# Altium schematic sheet CV060_IO.SchDoc
size A4
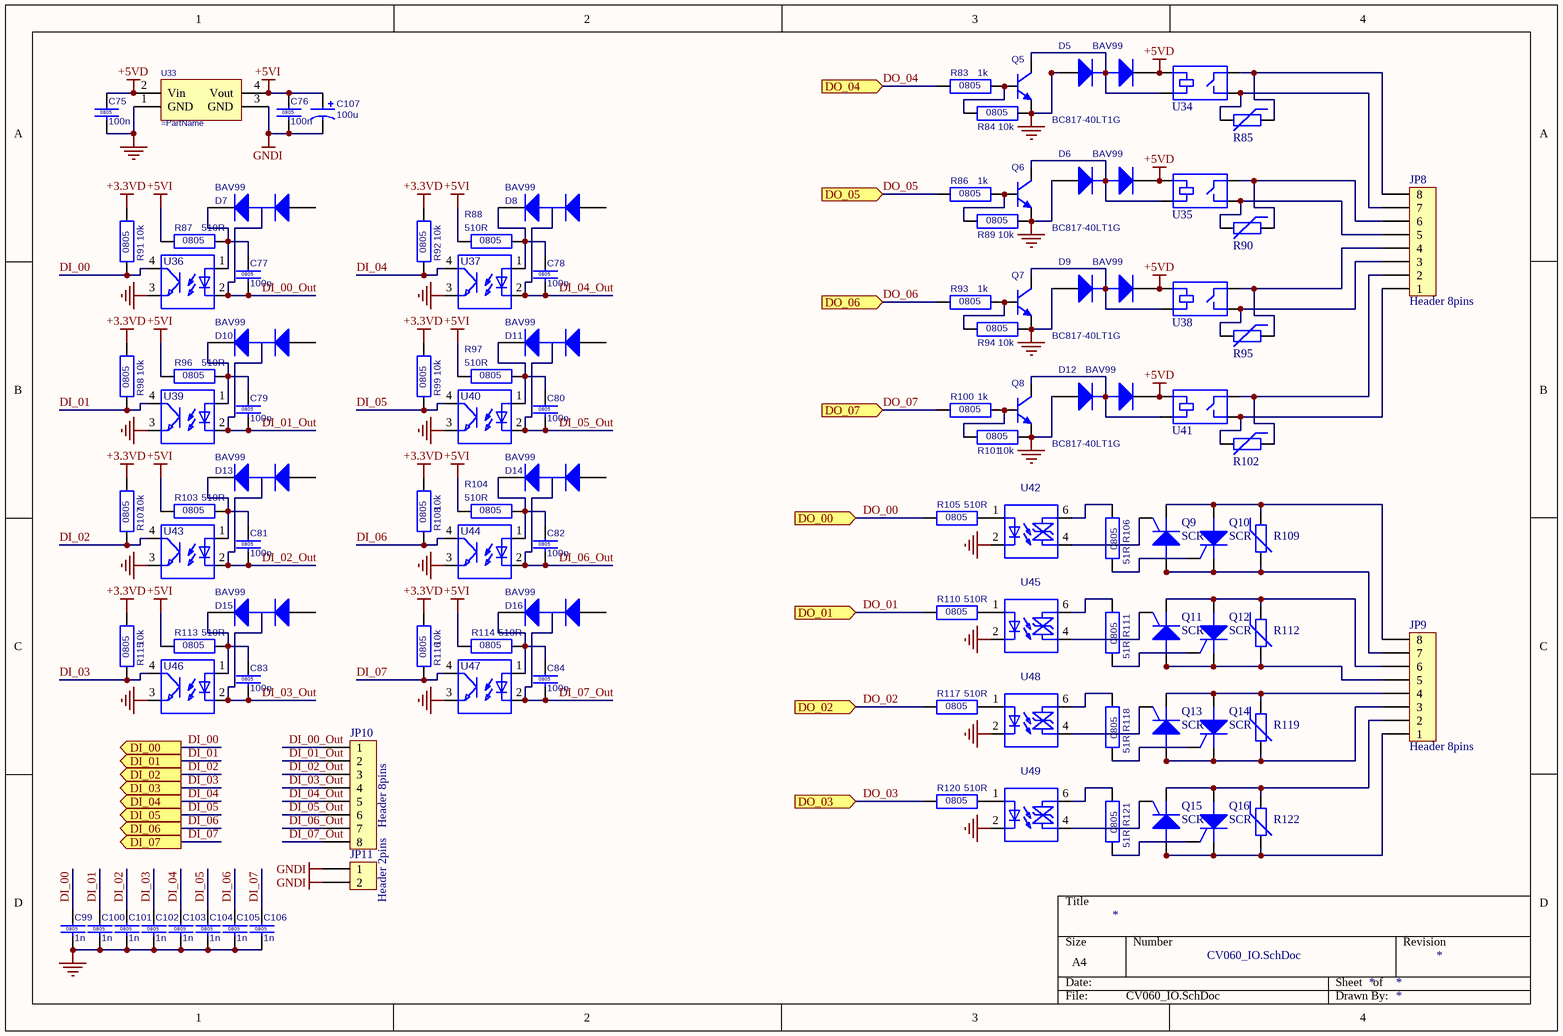
[diagram p0: CV060_IO.SchDoc]

## Parts
C75  Case: 0805  [RC0805]  (hidden comment: 100n)
C76  Case: 0805  [RC0805]  (hidden comment: 100n)
C77  Case: 0805  [RC0805]  (hidden comment: 100n)
C78  Case: 0805  [RC0805]  (hidden comment: 100n)
C79  Case: 0805  [RC0805]  (hidden comment: 100n)
C80  Case: 0805  [RC0805]  (hidden comment: 100n)
C81  Case: 0805  [RC0805]  (hidden comment: 100n)
C82  Case: 0805  [RC0805]  (hidden comment: 100n)
C83  Case: 0805  [RC0805]  (hidden comment: 100n)
C84  Case: 0805  [RC0805]  (hidden comment: 100n)
C99  Case: 0805  [RC0805]  (hidden comment: 1n)
C100  Case: 0805  [RC0805]  (hidden comment: 1n)
C101  Case: 0805  [RC0805]  (hidden comment: 1n)
C102  Case: 0805  [RC0805]  (hidden comment: 1n)
C103  Case: 0805  [RC0805]  (hidden comment: 1n)
C104  Case: 0805  [RC0805]  (hidden comment: 1n)
C105  Case: 0805  [RC0805]  (hidden comment: 1n)
C106  Case: 0805  [RC0805]  (hidden comment: 1n)
C107  100u  [CEH12.5D5P2.5]
D5  BAV99  [SOT23-3]
D6  BAV99  [SOT23-3]
D7  BAV99  [SOT23-3]
D8  BAV99  [SOT23-3]
D9  BAV99  [SOT23-3]
D10  BAV99  [SOT23-3]
D11  BAV99  [SOT23-3]
D12  BAV99  [SOT23-3]
D13  BAV99  [SOT23-3]
D14  BAV99  [SOT23-3]
D15  BAV99  [SOT23-3]
D16  BAV99  [SOT23-3]
JP8  Header 8pins  [PHOENIX_5.08_8PINS]
JP9  Header 8pins  [PHOENIX_5.08_8PINS]
JP10  Header 8pins  [PHOENIX_5.08_8PINS]
JP11  Header 2pins  [PHOENIX_5.08_2PINS]
Q5  Part number: BC817-40LT1G  [SOT23-3]  (hidden comment: NPN_transistor_SOT23-3)
Q6  Part number: BC817-40LT1G  [SOT23-3]  (hidden comment: NPN_transistor_SOT23-3)
Q7  Part number: BC817-40LT1G  [SOT23-3]  (hidden comment: NPN_transistor_SOT23-3)
Q8  Part number: BC817-40LT1G  [SOT23-3]  (hidden comment: NPN_transistor_SOT23-3)
Q9  SCR  [TO-220AB_V]
Q10  SCR  [TO-220AB_V]
Q11  SCR  [TO-220AB_V]
Q12  SCR  [TO-220AB_V]
Q13  SCR  [TO-220AB_V]
Q14  SCR  [TO-220AB_V]
Q15  SCR  [TO-220AB_V]
Q16  SCR  [TO-220AB_V]
R83  Case: 0805  [RC0805]  (hidden comment: 1k)
R84  Case: 0805  [RC0805]  (hidden comment: 10k)
R85  Varistor  [ROV07]  (value not drawn)
R86  Case: 0805  [RC0805]  (hidden comment: 1k)
R87  Case: 0805  [RC0805]  (hidden comment: 510R)
R88  Case: 0805  [RC0805]  (hidden comment: 510R)
R89  Case: 0805  [RC0805]  (hidden comment: 10k)
R90  Varistor  [ROV07]  (value not drawn)
R91  Case: 0805  [RC0805]  (hidden comment: 10k)
R92  Case: 0805  [RC0805]  (hidden comment: 10k)
R93  Case: 0805  [RC0805]  (hidden comment: 1k)
R94  Case: 0805  [RC0805]  (hidden comment: 10k)
R95  Varistor  [ROV07]  (value not drawn)
R96  Case: 0805  [RC0805]  (hidden comment: 510R)
R97  Case: 0805  [RC0805]  (hidden comment: 510R)
R98  Case: 0805  [RC0805]  (hidden comment: 10k)
R99  Case: 0805  [RC0805]  (hidden comment: 10k)
R100  Case: 0805  [RC0805]  (hidden comment: 1k)
R101  Case: 0805  [RC0805]  (hidden comment: 10k)
R102  Varistor  [ROV07]  (value not drawn)
R103  Case: 0805  [RC0805]  (hidden comment: 510R)
R104  Case: 0805  [RC0805]  (hidden comment: 510R)
R105  Case: 0805  [RC0805]  (hidden comment: 510R)
R106  Case: 0805  [RC0805]  (hidden comment: 51R)
R107  Case: 0805  [RC0805]  (hidden comment: 10k)
R108  Case: 0805  [RC0805]  (hidden comment: 10k)
R109  Varistor  [ROV07]  (value not drawn)
R110  Case: 0805  [RC0805]  (hidden comment: 510R)
R111  Case: 0805  [RC0805]  (hidden comment: 51R)
R112  Varistor  [ROV07]  (value not drawn)
R113  Case: 0805  [RC0805]  (hidden comment: 510R)
R114  Case: 0805  [RC0805]  (hidden comment: 510R)
R115  Case: 0805  [RC0805]  (hidden comment: 10k)
R116  Case: 0805  [RC0805]  (hidden comment: 10k)
R117  Case: 0805  [RC0805]  (hidden comment: 510R)
R118  Case: 0805  [RC0805]  (hidden comment: 51R)
R119  Varistor  [ROV07]  (value not drawn)
R120  Case: 0805  [RC0805]  (hidden comment: 510R)
R121  Case: 0805  [RC0805]  (hidden comment: 51R)
R122  Varistor  [ROV07]  (value not drawn)
U33  (no value)  [SIP4]
U34  NPA-AS5-DC5V  [NPA-AS5-DC5V]  (value not drawn)
U35  NPA-AS5-DC5V  [NPA-AS5-DC5V]  (value not drawn)
U36  PC817  [DIP4]  (value not drawn)
U37  PC817  [DIP4]  (value not drawn)
U38  NPA-AS5-DC5V  [NPA-AS5-DC5V]  (value not drawn)
U39  PC817  [DIP4]  (value not drawn)
U40  PC817  [DIP4]  (value not drawn)
U41  NPA-AS5-DC5V  [NPA-AS5-DC5V]  (value not drawn)
U42  MOC3063  [DIP6]  (value not drawn)
U43  PC817  [DIP4]  (value not drawn)
U44  PC817  [DIP4]  (value not drawn)
U45  MOC3063  [DIP6]  (value not drawn)
U46  PC817  [DIP4]  (value not drawn)
U47  PC817  [DIP4]  (value not drawn)
U48  MOC3063  [DIP6]  (value not drawn)
U49  MOC3063  [DIP6]  (value not drawn)

## Ports
DI_00 (out), DI_01 (out), DI_02 (out), DI_03 (out), DI_04 (out), DI_05 (out), DI_06 (out), DI_07 (out), DO_00 (in), DO_01 (in), DO_02 (in), DO_03 (in), DO_04 (in), DO_05 (in), DO_06 (in), DO_07 (in)

## Nets
+3.3VD: R91.2 R92.2 R98.2 R99.2 R107.2 R108.2 R115.2 R116.2
+5VD: C75.1 D5.2(K) D6.2(K) D9.2(K) D12.2(K) U33.2(Vin) U34.1 U35.1 U38.1 U41.1
+5VI: C76.1 C107.1 R87.1 R88.1 R96.1 R97.1 R103.1 R104.1 R113.1 R114.1 U33.4(Vout)
DGND: C75.2 C99.2 C100.2 C101.2 C102.2 C103.2 C104.2 C105.2 C106.2 D5.1(A) D6.1(A) D9.1(A) D12.1(A) Q5.2(E) Q6.2(E) Q7.2(E) Q8.2(E) R84.2 R89.2 R94.2 R101.2 U33.1(GND) U36.3 U37.3 U39.3 U40.3 U42.2 U43.3 U44.3 U45.2 U46.3 U47.3 U48.2 U49.2
GNDI: C76.2 C107.2 JP11.1 JP11.2 U33.3(GND)
DI_00: C99.1 R91.1 U36.4 ; port DI_00
DI_00_Out: C77.2 D7.3(C) JP10.1 U36.2
DI_01: C100.1 R98.1 U39.4 ; port DI_01
DI_01_Out: C79.2 D10.3(C) JP10.2 U39.2
DI_02: C101.1 R107.1 U43.4 ; port DI_02
DI_02_Out: C81.2 D13.3(C) JP10.3 U43.2
DI_03: C102.1 R115.1 U46.4 ; port DI_03
DI_03_Out: C83.2 D15.3(C) JP10.4 U46.2
DI_04: C103.1 R92.1 U37.4 ; port DI_04
DI_04_Out: C78.2 D8.3(C) JP10.5 U37.2
DI_05: C104.1 R99.1 U40.4 ; port DI_05
DI_05_Out: C80.2 D11.3(C) JP10.6 U40.2
DI_06: C105.1 R108.1 U44.4 ; port DI_06
DI_06_Out: C82.2 D14.3(C) JP10.7 U44.2
DI_07: C106.1 R116.1 U47.4 ; port DI_07
DI_07_Out: C84.2 D16.3(C) JP10.8 U47.2
DO_00: R105.1 ; port DO_00
DO_01: R110.1 ; port DO_01
DO_02: R117.1 ; port DO_02
DO_03: R120.1 ; port DO_03
DO_04: R83.1 ; port DO_04
DO_05: R86.1 ; port DO_05
DO_06: R93.1 ; port DO_06
DO_07: R100.1 ; port DO_07
NetC77_1: C77.1 D7.2(K) R87.2 U36.1
NetC78_1: C78.1 D8.2(K) R88.2 U37.1
NetC79_1: C79.1 D10.2(K) R96.2 U39.1
NetC80_1: C80.1 D11.2(K) R97.2 U40.1
NetC81_1: C81.1 D13.2(K) R103.2 U43.1
NetC82_1: C82.1 D14.2(K) R104.2 U44.1
NetC83_1: C83.1 D15.2(K) R113.2 U46.1
NetC84_1: C84.1 D16.2(K) R114.2 U47.1
NetD5_3: D5.3(C) Q5.3(C) U34.2
NetD6_3: D6.3(C) Q6.3(C) U35.2
NetD9_3: D9.3(C) Q7.3(C) U38.2
NetD12_3: D12.3(C) Q8.3(C) U41.2
NetJP8_1: JP8.1 R102.2 U41.4
NetJP8_2: JP8.2 R102.1 U41.3
NetJP8_3: JP8.3 R95.2 U38.4
NetJP8_4: JP8.4 R95.1 U38.3
NetJP8_5: JP8.5 R90.2 U35.4
NetJP8_6: JP8.6 R90.1 U35.3
NetJP8_7: JP8.7 R85.2 U34.4
NetJP8_8: JP8.8 R85.1 U34.3
NetJP9_1: JP9.1 Q15.2(A) Q15.4(TAB) Q16.1(K) R122.2
NetJP9_2: JP9.2 Q15.1(K) Q16.2(A) Q16.4(TAB) R122.1
NetJP9_3: JP9.3 Q13.2(A) Q13.4(TAB) Q14.1(K) R119.2
NetJP9_4: JP9.4 Q13.1(K) Q14.2(A) Q14.4(TAB) R119.1
NetJP9_5: JP9.5 Q11.2(A) Q11.4(TAB) Q12.1(K) R112.2
NetJP9_6: JP9.6 Q11.1(K) Q12.2(A) Q12.4(TAB) R112.1
NetJP9_7: JP9.7 Q9.2(A) Q9.4(TAB) Q10.1(K) R109.2
NetJP9_8: JP9.8 Q9.1(K) Q10.2(A) Q10.4(TAB) R109.1
NetQ5_1: Q5.1(B) R83.2 R84.1
NetQ6_1: Q6.1(B) R86.2 R89.1
NetQ7_1: Q7.1(B) R93.2 R94.1
NetQ8_1: Q8.1(B) R100.2 R101.1
NetQ9_3: Q9.3(G) U42.4
NetQ10_3: Q10.3(G) R106.2
NetQ11_3: Q11.3(G) U45.4
NetQ12_3: Q12.3(G) R111.2
NetQ13_3: Q13.3(G) U48.4
NetQ14_3: Q14.3(G) R118.2
NetQ15_3: Q15.3(G) U49.4
NetQ16_3: Q16.3(G) R121.2
NetR105_2: R105.2 U42.1
NetR106_1: R106.1 U42.6
NetR110_2: R110.2 U45.1
NetR111_1: R111.1 U45.6
NetR117_2: R117.2 U48.1
NetR118_1: R118.1 U48.6
NetR120_2: R120.2 U49.1
NetR121_1: R121.1 U49.6

Not connected (* = marked no-connect by the designer): D7 1(A); D8 1(A); D10 1(A); D11 1(A); D13 1(A); D14 1(A); D15 1(A); D16 1(A)

## Library data of the parts
C75-C84 = CC0805K-X5R-50V0-100N: Chip capacitor, 20p; Manufacturer: KEMET, YAGEO; Voltage: 50V; Tolerance: 10%; ROSH: Yes; Material: X5R; Package: 7" paper reel; Part number: CC0805K-X5R-50V0-100N; Suppliers: Avnet; Temperature: -55 - +125 C; Value: 100n; Supplier: Avnet-Abacus; Pb Free: Yes; Component Type: Standard; ComponentLink1Description: Manufacturer Link; ComponentLink2Description: Datasheet; ComponentLink2URL: http://www.yageo.com/pdf/UPY-GPHC_X5R_6.3V-to-50V_3.pdf; Published: 05.04.2010; Publisher: ppavlov
C99-C106 = CC0805K-X5R-50V0-1N00: Chip capacitor, 20p; Manufacturer: KEMET, YAGEO; Voltage: 50V; Tolerance: 10%; ROSH: Yes; Material: X5R; Package: 7" paper reel; Part number: CC0805K-X5R-50V0-1N00; Suppliers: Avnet; Temperature: -55 - +125 C; Value: 1n; Supplier: Avnet-Abacus; Pb Free: Yes; Component Type: Standard; ComponentLink1Description: Manufacturer Link; ComponentLink2Description: Datasheet; ComponentLink2URL: http://www.yageo.com/pdf/UPY-GPHC_X5R_6.3V-to-50V_3.pdf; Published: 05.04.2010; Publisher: ppavlov
C107 = CEH12.5D5P2.5M-16V-100U: Electrolytic capacitor; Manufacturer: Panasonic; Manufacturer Part Number: C H12.5D5P2.5M-16V-100U; Voltage: 16V; Tolerance: 20%; Pb Free: Yes; Case: 12.5x5x2.5; Value: 100u; Part Number: CEH12.5D5P2.5M-16V-100U; Temperature: -55 - +105 C; Supplier: Megasan; MOQ: 500; Component Type: Standard; ComponentLink1Description: Manufacturer Link; ComponentLink2Description: Datasheet; ComponentLink2URL: http://industrial.panasonic.com/www-data/pdf/ABA0000/ABA0000CE22.pdf; Published: 11.12.2009; Publisher: ppavlov
D5-D16 = BAV99: Dual small signal diode; Manufacturer: Fairchild; Forward current: 0.2A; Breakdown Voltage: 70V; Pb Free: Yes; Stock ID: D040; Temperature: -55 - +150 C; Supplier: EBV; Manufacturer Part Number: BAV99; Component Type: Standard; ComponentLink1Description: Manufacturer Link; Case: SOT23-3; ComponentLink2Description: Datasheet; ComponentLink2URL: http://www.fairchildsemi.com/ds/BA%2FBAV99.pdf; Published: 16.11.2009; Publisher: tkondratyuk; Part Number: BAV99; Current: 0.2A; Voltage: 70V
JP8-JP10 = 2EDGR-5.08-08P-14: 5.08mm angled 8pins receptabe; Manufacturer Part Number: 2EDGR-5.0-08P-14; Pins number: 8; Pb Free: Yes; Part Number: 2EDGR-5.08-08P-14; Temperature: -40 - +105 C; Supplier: Biakom; Component Type: Standard; ComponentLink1Description: Manufacturer Link; Case: PHOENIX_5.08_8PINS; ComponentLink2Description: Datasheet; Published: 17.08.2010; Publisher: ppavlov
JP11 = 2EDGR-5.08-02P-14: 5mm angled 2pins receptabe; Manufacturer Part Number: 2EDGR-5.0-02P-14; Pins number: 2; Pb Free: Yes; Part Number: 2EDGR-5.08-02P-14; Temperature: -40 - +105 C; Component Type: Standard; ComponentLink1Description: Manufacturer Link; Case: PHOENIX_5.08_2PINS; ComponentLink2Description: Datasheet; Published: 04.01.2010; Publisher: ppavlov
Q5-Q8 = BC817-40LT1G: General Purpose  NPN Transistor; Manufacturer: ONS, NXP; Manufacturer Part Number: BC817?40LT1G; Current: 0.5A; Voltage CEO: 40V; Pb Free: Yes; Temperature: -55 - +150 C; Supplier: EBV; MOQ: 3000; Package: Tape and Reel; Component Type: Standard; ComponentLink1Description: Manufacturer Link; Case: SOT23-3; ComponentLink2Description: Datasheet; ComponentLink2URL: http://www.onsemi.com/pub/Collateral/BC817-16LT1-D.PDF; Published: 16.02.2010; Publisher: ppavlov
Q9-Q16 = BT151-800_V: Thyristor; Current: 8A; Voltage CEO: 800; Pb Free: Yes; Part Number: BT151-800_V; Temperature: -55 - +150 C; Manufacturer Part Number: BT151-800; Component Type: Standard; ComponentLink1Description: Manufacturer Link; Case: TO-220AB_H; ComponentLink2Description: Datasheet; Published: 08.04.2010; Publisher: ppavlov
R83 R86 R93 R100 = RC0805F-1K00: Chip resistor; Manufacturer: PHILIPS, SAMSUNG; Voltage: 200V; Power: 1/10W; Tolerance: 1%; Pb Free: Yes; Value: 1k; Part Number: RC0805F-1K00; Temperature: -55 - +155 C; Supplier: Megasan; Component Type: Standard; ComponentLink1Description: Manufacturer Link; ComponentLink2Description: Datasheet; ComponentLink2URL: http://www.yageo.com/pdf/PYu-RC1206_51_RoHS_L_4.pdf; Published: 11.12.2009; Publisher: ppavlov
R84 R89 R91 R92 R94 R98 R99 R101 R107 R108 R115 R116 = RC0805F-10K0: Chip resistor; Manufacturer: PHILIPS, SAMSUNG; Voltage: 200V; Power: 1/10W; Tolerance: 1%; Pb Free: Yes; Value: 10k; Part Number: RC0805F-10K0; Temperature: -55 - +155 C; Supplier: Megasan; Component Type: Standard; ComponentLink1Description: Manufacturer Link; ComponentLink2Description: Datasheet; ComponentLink2URL: http://www.yageo.com/pdf/PYu-RC1206_51_RoHS_L_4.pdf; Published: 11.12.2009; Publisher: ppavlov
R85 R90 R95 R102 R109 R112 R119 R122 = ROV07-391K: Manufacturer: Raychem; Manufacturer Part Number: ROV07-361K; Current: 10A; Voltage: 250AC; Pb Free: Yes; Part Number: ROV07-391K; Temperature: -40 - +125 C; Component Type: Standard; ComponentLink1Description: Manufacturer Link; Case: ROV07; ComponentLink2Description: Datasheet; Published: 17.08.2010; Publisher: ppavlov
R87 R88 R96 R97 R103-R105 R110 R113 R114 R117 R120 = RC0805F-510R: Chip resistor; Manufacturer: PHILIPS, SAMSUNG; Voltage: 200V; Power: 1/10W; Tolerance: 1%; Pb Free: Yes; Value: 510R; Part Number: RC0805F-510R; Temperature: -55 - +155 C; Supplier: Megasan; Component Type: Standard; ComponentLink1Description: Manufacturer Link; ComponentLink2Description: Datasheet; ComponentLink2URL: http://www.yageo.com/pdf/PYu-RC1206_51_RoHS_L_4.pdf; Published: 11.12.2009; Publisher: ppavlov
R106 R111 R118 R121 = RC0805F-51R0: Chip resistor; Manufacturer: PHILIPS, SAMSUNG; Voltage: 200V; Power: 1/10W; Tolerance: 1%; Pb Free: Yes; Value: 51R; Part Number: RC0805F-51R0; Temperature: -55 - +155 C; Supplier: Megasan; Component Type: Standard; ComponentLink1Description: Manufacturer Link; ComponentLink2Description: Datasheet; ComponentLink2URL: http://www.yageo.com/pdf/PYu-RC1206_51_RoHS_L_4.pdf; Published: 11.12.2009; Publisher: ppavlov
U33 = 1-05-05S: 1W Insulated DCDC converter; Manufacturer: TI; Manufacturer Part Number: E101E; Pb Free: Yes; Part Number: 1-05-05S; Temperature: -40 - +85 C; Component Type: Standard; ComponentLink1Description: Manufacturer Link; Case: SIP4; ComponentLink2Description: Datasheet; Published: 07.01.2010; Publisher: ppavlov
U34 U35 U38 U41 = NPA-AS5-DC5V: Standard; Part Number: NPA-AS5-DC5V; Manufacturer Part Number: NPA-AS5-DC5V; Package: NPA-AS5-DC5V; Component Type: Relay; Case: NPA-AS5-DC5V; Published: 05.04.2010; Publisher: ppavlov; ComponentLink2Description: Datasheet
U36 U37 U39 U40 U43 U44 U46 U47 = PC817C: General purpose optocouple; Manufacturer: Sharp; Part Number: PC817C; Manufacturer Part Number: PC817C; Component Type: Standard; ComponentLink1Description: Manufacturer Link; Case: DIP4; ComponentLink2Description: Datasheet; Published: 06.04.2010; Publisher: ppavlov
U42 U45 U48 U49 = MOC3063: Zero-Cross Phototriac Driver Optocoupler; Manufacturer: Fairchild; Part Number: MOC3063; Manufacturer Part Number: MOC3063; Component Type: Standard; ComponentLink1Description: Manufacturer Link; Case: DIP6; ComponentLink2Description: Datasheet; ComponentLink2URL: http://www.fairchildsemi.com/ds/MO%2FMOC3061-M.pdf; Published: 06.04.2010; Publisher: ppavlov